# Altium schematic sheet ModdedTSCircuit.SchDoc
size 508 x 241 mm; SheetNumber: 1; SheetTotal: 1
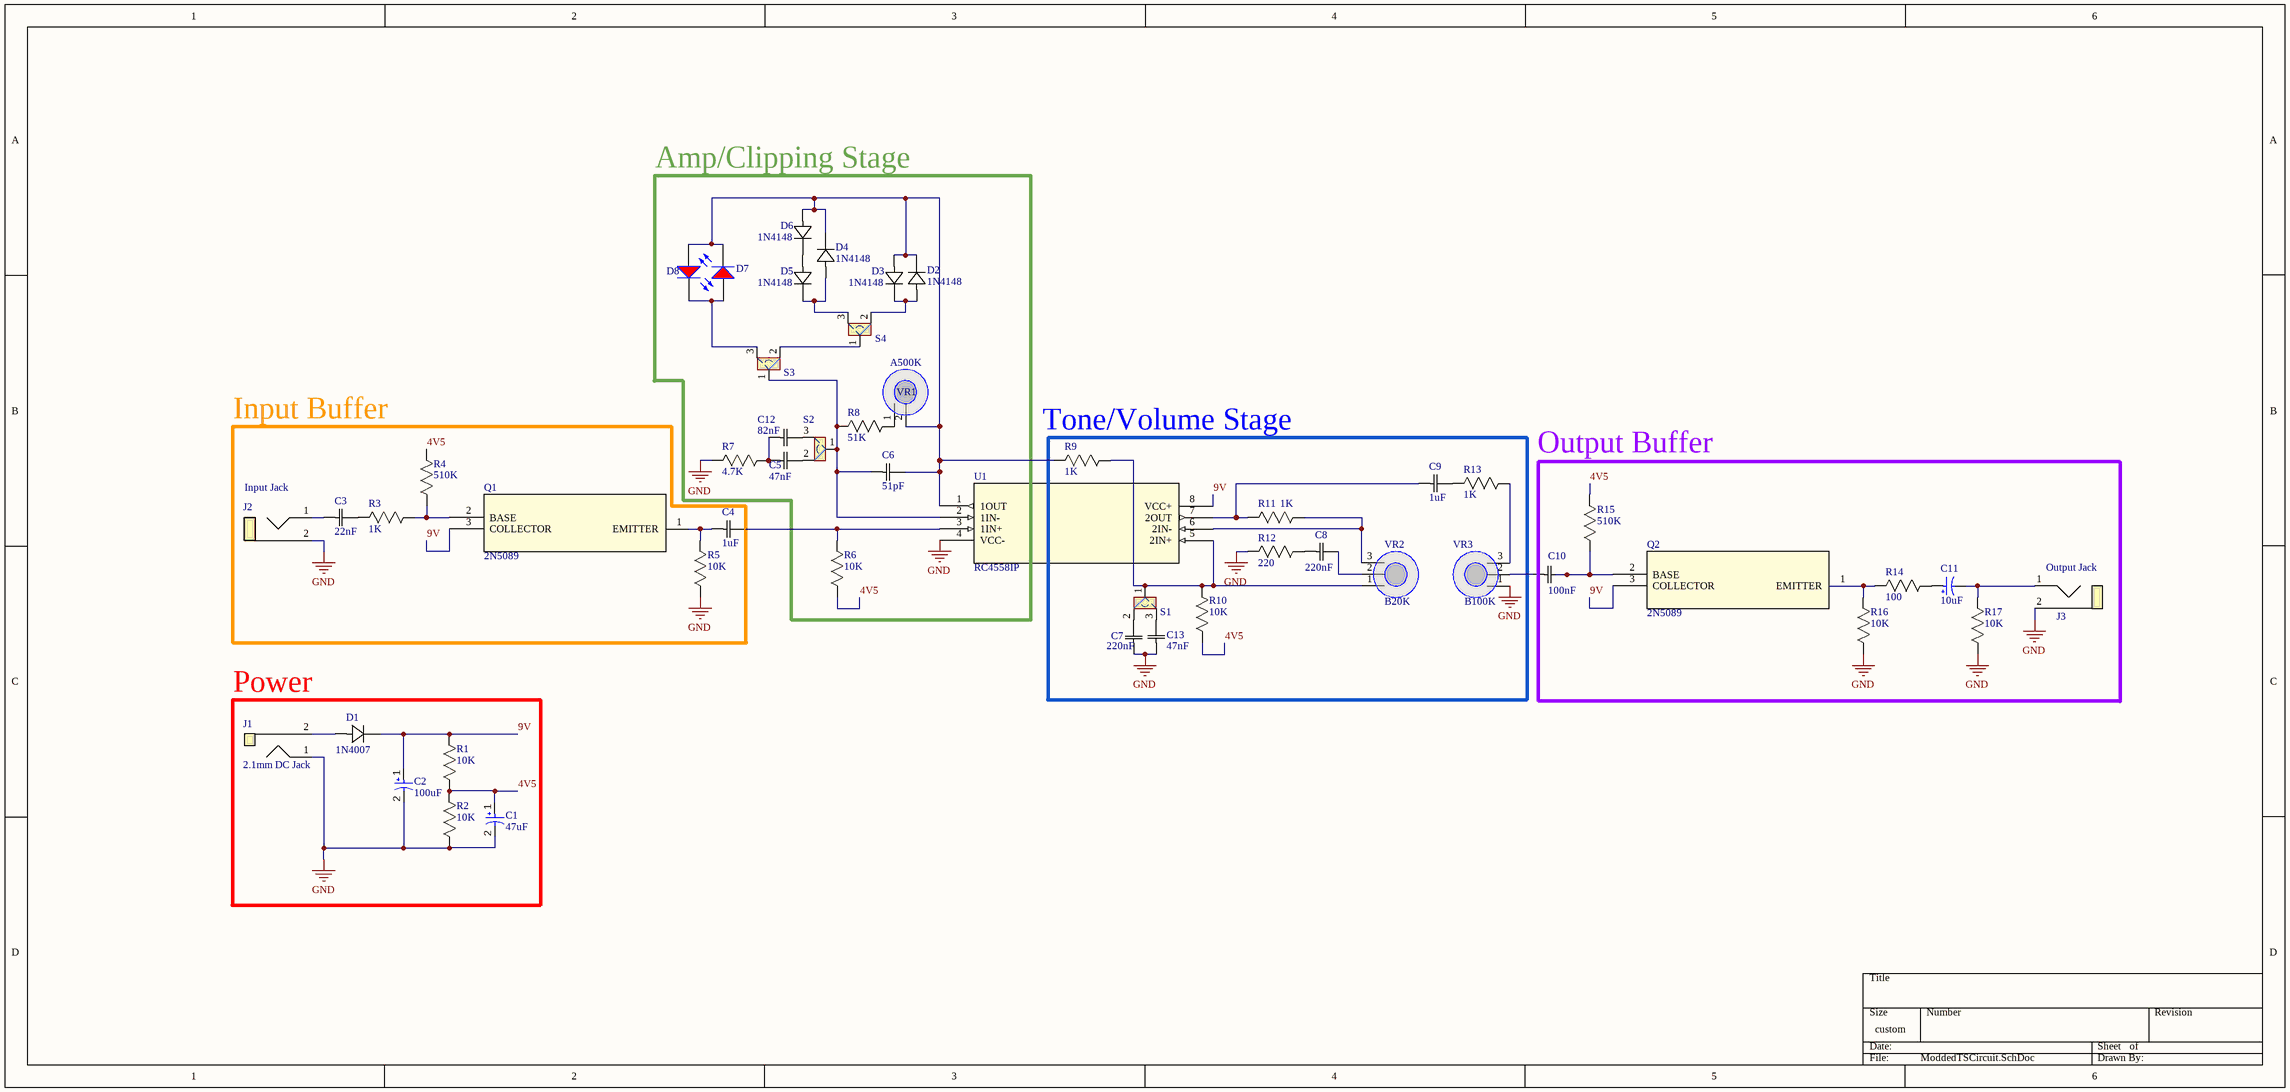
[diagram p0: ModdedTSCircuit.SchDoc]

## Parts
C1  47uF  [CAP_35YXJ47M5X11]
C2  100uF  [CAP_25PX100MEFC5X11]
C3  22nF  [CAP_R82EC2220SH50J]
C4  1uF  [CAP_R82DC4100AA60K]
C5  47nF  [CAP_R82EC2470SH60J]
C6  51pF  [CAP_C315C510K3G5TA]
C7  220nF  [CAP_R82DC3220Z360J]
C8  220nF  [CAP_R82DC3220Z360J]
C9  1uF  [CAP_R82DC4100AA60K]
C10  100nF  [CAP_R82DC3100AA50K]
C11  10uF  [CAP_63PX10MEFC5X11]
C12  82nF  [CAP_R82EC2820SH60J]
C13  47nF  [CAP_R82EC2470SH60J]
D1  1N4007  [DIODE_1N4007FFG]
D2  1N4148  [DIODE_1N4148-T50R]
D3  1N4148  [DIODE_1N4148-T50R]
D4  1N4148  [DIODE_1N4148-T50R]
D5  1N4148  [DIODE_1N4148-T50R]
D6  1N4148  [DIODE_1N4148-T50R]
D7  Red, 2.1V, 60°  [LED_151051RS11000]  (value not drawn)
D8  Red, 2.1V, 60°  [LED_151051RS11000]  (value not drawn)
J1  2.1mm DC Jack  [DC_POWER_JACK_OFFBOARD]
J2  Input Jack  [JACK_MONO_OFFBOARD]
J3  Output Jack  [JACK_MONO_OFFBOARD]
Q1  2N5089  [BJT_2N5089]
Q2  2N5089  [BJT_2N5089]
R1  10K  [R_MFR-25FRF52-10K]
R2  10K  [R_MFR-25FRF52-10K]
R3  1K  [R_MFR-25FRF52-1K]
R4  510K  [R_MFR-25FTE52-510K]
R5  10K  [R_MFR-25FRF52-10K]
R6  10K  [R_MFR-25FRF52-10K]
R7  4.7K  [R_MFR-25FTE52-4K7]
R8  51K  [R_MFR-25FTE52-51K]
R9  1K  [R_MFR-25FRF52-1K]
R10  10K  [R_MFR-25FRF52-10K]
R11  1K  [R_MFR-25FRF52-1K]
R12  220  [R_MFR-25FTE52-220R]
R13  1K  [R_MFR-25FRF52-1K]
R14  100  [R_MFR-25FRF52-100R]
R15  510K  [R_MFR-25FTE52-510K]
R16  10K  [R_MFR-25FRF52-10K]
R17  10K  [R_MFR-25FRF52-10K]
S1  SPDT_TOGGLE_SWITCH_OFFBOARD  [SPDT_TOGGLE_SWITCH_OFFBOARD]  (value not drawn)
S2  SPDT_TOGGLE_SWITCH_OFFBOARD  [SPDT_TOGGLE_SWITCH_OFFBOARD]  (value not drawn)
S3  SPDT_TOGGLE_SWITCH_OFFBOARD  [SPDT_TOGGLE_SWITCH_OFFBOARD]  (value not drawn)
S4  SPDT_TOGGLE_SWITCH_OFFBOARD  [SPDT_TOGGLE_SWITCH_OFFBOARD]  (value not drawn)
U1  RC4558IP  [OPAMP_RC4558IP]
VR1  A500K  [POT_500K_LOG_OFFBOARD]
VR2  B20K  [POT_20K_LIN_OFFBOARD]
VR3  B100K  [POT_100K_LIN_OFFBOARD]

## Blocks framed on the sheet
Amp/Clipping Stage: C5 C6 C12 D2-D8 R6-R8 S2-S4 VR1
Input Buffer: C3 C4 J2 Q1 R3-R5
Output Buffer: C10 C11 J3 Q2 R14-R17
Power: C1 C2 D1 J1 R1 R2

## Nets
GND: C1.2 C2.2 C7.1 C13.1 J1.1(TIP) J2.2(SLEEVE) J3.2(SLEEVE) R2.1 R5.1 R7.1 R12.1 R16.1 R17.1 U1.4(VCC-) VR3.1
4V5: C1.1 R1.1 R2.2 R4.2 R6.1 R10.1 R15.2
9V: C2.1 D1.1 Q1.3(COLLECTOR) Q2.3(COLLECTOR) R1.2 U1.8(VCC+)
NetC3_1: C3.1 J2.1(TIP)
NetC3_2: C3.2 R3.1
NetC4_1: C4.1 Q1.1(EMITTER) R5.2
NetC4_2: C4.2 R6.2 U1.3(1IN+)
NetC5_1: C5.1 C12.1 R7.2
NetC5_2: C5.2 S2.2
NetC6_1: C6.1 R8.1 S2.1 S3.1 U1.2(1IN-)
NetC6_2: C6.2 D2.1 D3.2 D4.1 D6.2 D7.2(K) D8.1(A) R9.1 U1.1(1OUT) VR1.2
NetC7_2: C7.2 S1.2
NetC8_1: C8.1 R12.2
NetC8_2: C8.2 VR2.2
NetC9_1: C9.1 R11.1 U1.7(2OUT)
NetC9_2: C9.2 R13.1
NetC10_1: C10.1 VR3.2
NetC10_2: C10.2 Q2.2(BASE) R15.1
NetC11_1: C11.1 R14.2
NetC11_2: C11.2 J3.1(TIP) R17.2
NetC12_2: C12.2 S2.3
NetC13_2: C13.2 S1.3
NetD1_2: D1.2 J1.2(SLEEVE)
NetD2_2: D2.2 D3.1 S4.2
NetD4_2: D4.2 D5.1 S4.3
NetD5_2: D5.2 D6.1
NetD7_1: D7.1(A) D8.2(K) S3.3
NetQ1_2: Q1.2(BASE) R3.2 R4.1
NetQ2_1: Q2.1(EMITTER) R14.1 R16.2
NetR8_2: R8.2 VR1.1
NetR9_2: R9.2 R10.2 S1.1 U1.5(2IN+) VR2.1
NetR11_2: R11.2 U1.6(2IN-) VR2.3
NetR13_2: R13.2 VR3.3
NetS3_2: S3.2 S4.1

## Notes on the sheet
- (near R9) Tone/Volume Stage

## Library data of the parts
C1 = 35YXJ47M5X11: 47 µF 35 V Aluminum Electrolytic Capacitors Radial, Can 5000 Hrs @ 105°C; Manufacturer_Name: Rubycon; Copyright: Copyright (C) 2026 Ultra Librarian. All rights reserved.; Manufacturer_Part_Number: 35YXJ47M5X11
C2 = 25PX100MEFC5X11: 100 µF 25 V Aluminum Electrolytic Capacitors Radial, Can 1000 Hrs @ 105°C; Manufacturer_Name: Rubycon; Copyright: Copyright (C) 2025 Ultra Librarian. All rights reserved.; Manufacturer_Part_Number: 25PX100MEFC5X11
C3 = R82EC2220SH50J: 0.022 µF Film Capacitor 63V 100V Polyester, Polyethylene Terephthalate (PET), Metallized - Stacked Radial; Manufacturer_Name: Kemet; Type: Film Capacitor; Copyright: Copyright (C) 2026 Ultra Librarian. All rights reserved.; Manufacturer_Part_Number: R82EC2220SH50J; Datasheet: https://content.kemet.com/datasheets/KEM_F3101_R82.pdf
C4 C9 = R82DC4100AA60K: 1 µF Film Capacitor 40V 63V Polyester, Polyethylene Terephthalate (PET), Metallized - Stacked Radial; Manufacturer_Name: Kemet; Type: Film Capacitor; Copyright: Copyright (C) 2026 Ultra Librarian. All rights reserved.; Manufacturer_Part_Number: R82DC4100AA60K
C5 C13 = R82EC2470SH60J: 0.047 µF Film Capacitor 63V 100V Polyester, Polyethylene Terephthalate (PET), Metallized - Stacked Radial; Manufacturer_Name: Kemet; Type: Film Capacitor; Copyright: Copyright (C) 2026 Ultra Librarian. All rights reserved.; Manufacturer_Part_Number: R82EC2470SH60J; Datasheet: https://content.kemet.com/datasheets/KEM_F3101_R82.pdf
C6 = C315C510K3G5TA: 51 pF ±10% 25V Ceramic Capacitor C0G, NP0 Radial; Manufacturer_Name: Kemet; Copyright: Copyright (C) 2026 Ultra Librarian. All rights reserved.; Manufacturer_Part_Number: C315C510K3G5TA
C7 C8 = R82DC3220Z360J: 0.22 µF Film Capacitor 40V 63V Polyester, Polyethylene Terephthalate (PET), Metallized - Stacked Radial; Manufacturer_Name: Kemet; Type: Film Capacitor; Copyright: Copyright (C) 2026 Ultra Librarian. All rights reserved.; Manufacturer_Part_Number: R82DC3220Z360J; Datasheet: https://content.kemet.com/datasheets/KEM_F3101_R82.pdf
C10 = R82DC3100AA50K: 0.1 µF Film Capacitor 40V 63V Polyester, Polyethylene Terephthalate (PET), Metallized - Stacked Radial; Manufacturer_Name: Kemet; Type: Film Capacitor; Copyright: Copyright (C) 2026 Ultra Librarian. All rights reserved.; Manufacturer_Part_Number: R82DC3100AA50K; Datasheet: https://content.kemet.com/datasheets/KEM_F3101_R82.pdf
C11 = 63PX10MEFC5X11: 10 µF 63 V Aluminum Electrolytic Capacitors Radial, Can 1000 Hrs @ 105°C; Manufacturer_Name: Rubycon; Copyright: Copyright (C) 2025 Ultra Librarian. All rights reserved.; Manufacturer_Part_Number: 63PX10MEFC5X11
C12 = R82EC2820SH60J: 0.082 µF Film Capacitor 63V 100V Polyester, Polyethylene Terephthalate (PET), Metallized - Stacked Radial; Manufacturer_Name: Kemet; Type: Film Capacitor; Copyright: Copyright (C) 2026 Ultra Librarian. All rights reserved.; Manufacturer_Part_Number: R82EC2820SH60J; Datasheet: https://content.kemet.com/datasheets/KEM_F3101_R82.pdf
D1 = 1N4007FFG: Diode 1000 V 1A Through Hole Axial; Manufacturer_Name: onsemi; Manufacturer_Part_Number: 1N4007FFG
D2-D6 = 1N4148-T50R: Diode 100 V 200mA Through Hole DO-35; Manufacturer_Name: onsemi; Manufacturer_Part_Number: 1N4148-T50RCT-ND
D7 D8 = 151051RS11000: WL-TMRC Mono-color Round Color, THT, D5.9 x H8.7mm, Red, 2.1V, 60°; Manufacturer: Wurth Elektronik; Case/Size Code: 5mm; Chip Technology: AlGaInP; Dominant Wavelength: 645nm; Luminous Intensity: 30mcd; Peak Wavelength: 650nm; Manufacturer Part Number: 151051RS11000; Category: Signal LEDs; Match Code: WL-TMRC; ComponentLink1Description: Website Link; ComponentLink1URL: https://www.we-online.com/redexpert/article/151051RS11000?ad; ComponentLink2Description: Datasheet Link; ComponentLink2URL: https://www.we-online.com/redexpert/spec/151051RS11000?ad; Mount: Through Hole; Operating Temperature Max: 85°C; Operating Temperature Min: -40°C; Packaging: Bulk; Height: 8.7mm; Diameter: 5.9mm; Emitting Color: Red; Forward Voltage: 2.1V; Viewing Angle: 60°
J1 = DC_POWER_JACK_OFFBOARD: Power Barrel Connector Jack 2.10mm ID (0.083"), 5.50mm OD (0.217") Chassis Mount; Supplier 1: DigiKey; Supplier Part Number 1: EJ501A-ND
J2 J3 = JACK_MONO_OFFBOARD: 6.35mm (0.250", 1/4") - Headphone Phone Jack Mono Connector Solder Eyelet(s); Supplier 1: RS (Formerly Allied Electronics); Supplier Part Number 1: 11
Q1 Q2 = 2N5089: Bipolar (BJT) Transistor NPN 25 V 50 mA 50MHz 625 mW Through Hole TO-92-3; Manufacturer_Name: Central Semiconductor; Copyright: Copyright (C) 2025 Ultra Librarian. All rights reserved.; Manufacturer_Part_Number: 2N5089; RefDes: RefDes; Type: Type
R1 R2 R5 R6 R10 R16 R17 = MFR-25FRF52-10K: 10 kOhms ±1% 0.25W, 1/4W Through Hole Resistor Axial Metal Film; Manufacturer_Name: Yageo; Copyright: Copyright (C) 2025 Ultra Librarian. All rights reserved.; Manufacturer_Part_Number: MFR-25FRF52-10K
R3 R9 R11 R13 = MFR-25FRF52-1K: 1 kOhms ±1% 0.25W, 1/4W Through Hole Resistor Axial Metal Film; Manufacturer_Name: Yageo; Copyright: Copyright (C) 2025 Ultra Librarian. All rights reserved.; Manufacturer_Part_Number: MFR-25FRF52-1K
R4 R15 = MFR-25FTE52-510K: 510 kOhms ±1% 0.25W, 1/4W Through Hole Resistor Axial Metal Film; Manufacturer_Name: Yageo; Copyright: Copyright (C) 2025 Ultra Librarian. All rights reserved.; Manufacturer_Part_Number: MFR-25FTE52-510K
R7 = MFR-25FTE52-4K7: 4.7 kOhms ±1% 0.25W, 1/4W Through Hole Resistor Axial Metal Film; Manufacturer_Name: Yageo; Copyright: Copyright (C) 2025 Ultra Librarian. All rights reserved.; Manufacturer_Part_Number: MFR-25FTE52-4K7
R8 = MFR-25FTE52-51K: 51 kOhms ±1% 0.25W, 1/4W Through Hole Resistor Axial Metal Film; Manufacturer_Name: Yageo; Copyright: Copyright (C) 2025 Ultra Librarian. All rights reserved.; Manufacturer_Part_Number: MFR-25FTE52-51K
R12 = MFR-25FTE52-220R: 220 Ohms ±1% 0.25W, 1/4W Through Hole Resistor Axial Metal Film; Manufacturer_Name: Yageo; Copyright: Copyright (C) 2025 Ultra Librarian. All rights reserved.; Manufacturer_Part_Number: MFR-25FTE52-220R
R14 = MFR-25FRF52-100R: 100 Ohms ±1% 0.25W, 1/4W Through Hole Resistor Axial Metal Film; Manufacturer_Name: Yageo; Copyright: Copyright (C) 2025 Ultra Librarian. All rights reserved.; Manufacturer_Part_Number: MFR-25FRF52-100R
S1-S4 = SPDT_TOGGLE_SWITCH_OFFBOARD: Toggle Switch SPDT Panel Mount
U1 = RC4558IP: Standard (General Purpose) Amplifier 2 Circuit Differential 8-PDIP; Manufacturer_Name: Texas Instruments; Copyright: Copyright (C) 2025 Ultra Librarian. All rights reserved.; Manufacturer_Part_Number: RC4558IP; RefDes: RefDes; Type: Type
VR1 = POT_500K_LOG_OFFBOARD: A500K, 16mm Potentiometers - 18T Knurled Shaft - Solder Lug
VR2 = POT_20K_LIN_OFFBOARD: B20K, 16mm Potentiometers - 18T Knurled Shaft - Solder Lug
VR3 = POT_100K_LIN_OFFBOARD: B100K, 16mm Potentiometers - 18T Knurled Shaft - Solder Lug